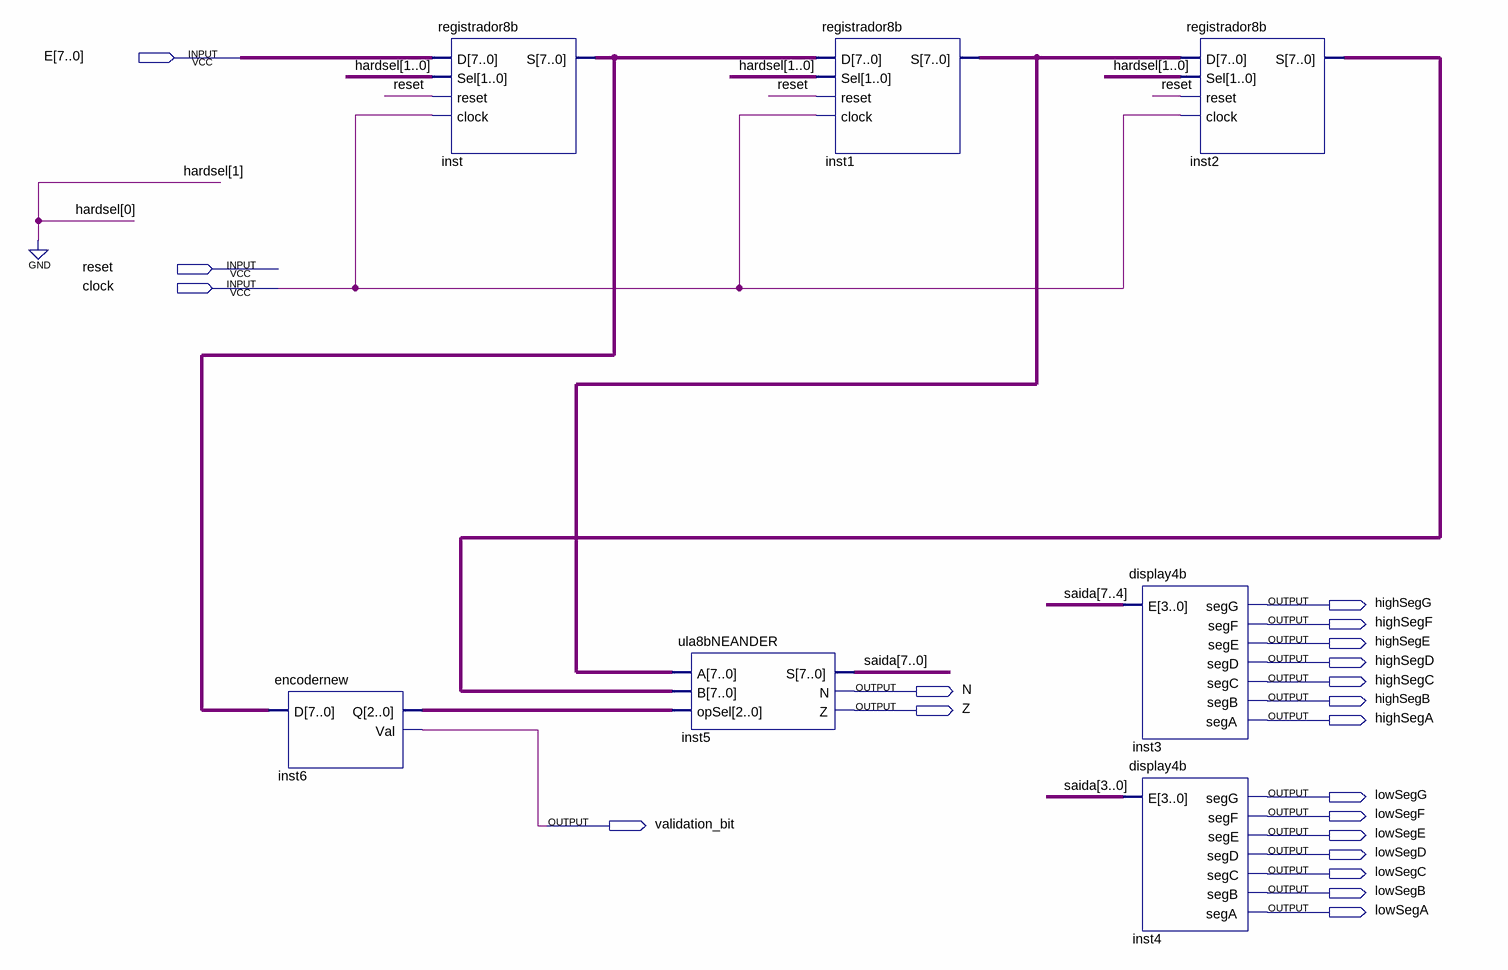
[diagram p0: schematic sheet]
// Quartus schematic testeula.bdf as structural Verilog: 7 symbols, 20 pins
module testeula (
  input  [7:0] E,
  input  reset,
  input  clock,
  output highSegG,
  output highSegF,
  output highSegE,
  output highSegD,
  output highSegC,
  output N,
  output highSegB,
  output Z,
  output highSegA,
  output lowSegG,
  output lowSegF,
  output validation_bit,
  output lowSegE,
  output lowSegD,
  output lowSegC,
  output lowSegB,
  output lowSegA
);

  wire [2:0] inst6_q;
  wire [7:0] inst1_s, inst2_s, inst_s, saida;

  encodernew inst6 (.D(inst_s), .Q(inst6_q), .Val(validation_bit));
  registrador8b inst (.D(E), .Sel(2'b00), .reset(reset), .clock(clock), .S(inst_s));
  ula8bNEANDER inst5 (.A(inst1_s), .B(inst2_s), .opSel(inst6_q), .S(saida), .N(N), .Z(Z));
  registrador8b inst1 (.D(inst_s), .Sel(2'b00), .reset(reset), .clock(clock), .S(inst1_s));
  display4b inst3 (
    .E(saida[7:4]), .segG(highSegG), .segF(highSegF), .segE(highSegE), .segD(highSegD), .segC(highSegC),
    .segB(highSegB), .segA(highSegA));
  display4b inst4 (
    .E(saida[3:0]), .segG(lowSegG), .segF(lowSegF), .segE(lowSegE), .segD(lowSegD), .segC(lowSegC),
    .segB(lowSegB), .segA(lowSegA));
  registrador8b inst2 (.D(inst1_s), .Sel(2'b00), .reset(reset), .clock(clock), .S(inst2_s));
endmodule
